# EAGLE design djshield2 (EAGLE 6.4)
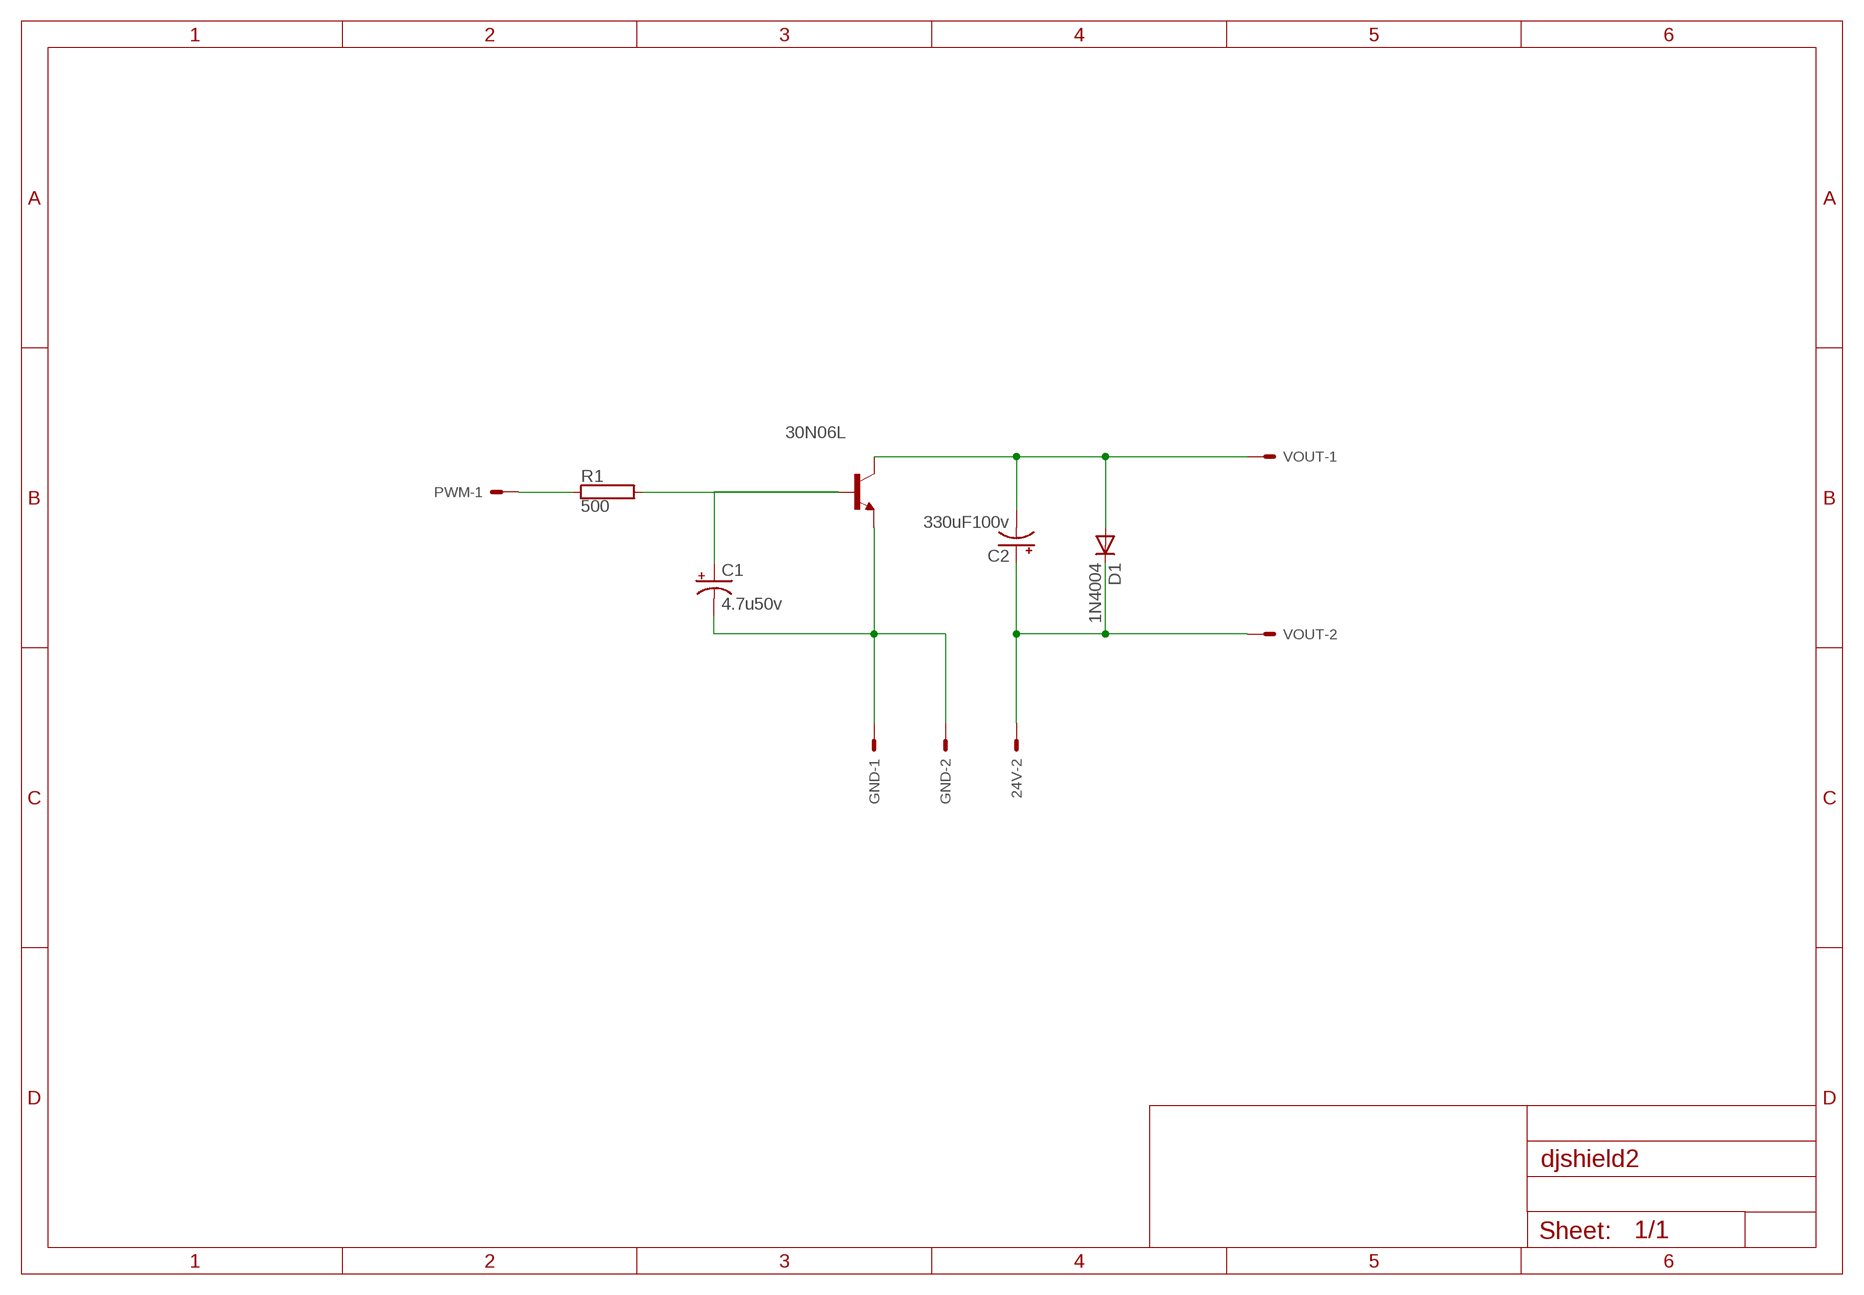
[diagram p0: schematic, sheet 1]

## Parts
24V  87758-0216  [87758-0216]
30N06L  -NPN-TO126  [TO126]
C1  4.7u50v  CPOL-USE1.8-4  [E1,8-4]
C2  330uF100v  CPOL-USE35-18AXIAL  [E35-18]
D1  1N4004  [DO41-10]
GND  87758-0216  [87758-0216]
PWM  87758-0216  [87758-0216]
R1  500  RRS1/4  [RS1/4]
VOUT  87758-0216  [87758-0216]

## Nets
N$1 [power]: 30N06L.1(E) C1.- GND.1 GND.2
N$2: 30N06L.2(C) C2.- D1.A VOUT.1
N$3: 24V.2 C2.+ D1.C VOUT.2
N$8: 30N06L.3(B) C1.+ R1.2
N$10 [power]: PWM.1 R1.1
Unconnected: 24V.1 PWM.2

## Library data of the parts
24V GND PWM VOUT = con-molex:87758-0216: 2 Pin - 2mm Dual Row Single Wafer, Vertical T/H HDR Source: http://www.molex.com/pdm_docs/sd/877580616_sd.pdf; MPN: 87758-0216; OC_FARNELL: unknown; OC_NEWARK: 94M1513
30N06L = transistor:*-NPN-: NPN Transistror BF959 corrected 2008.03.06
C1 = resistor:CPOL-US: POLARIZED CAPACITOR, American symbol
C2 = rcl:CPOL-US: POLARIZED CAPACITOR, American symbol
D1 = diode:1N4004: DIODE general purpose rectifier, 1 A
R1 = resistor-power:R: Power Resitor; MF: OHMITE; MPN: RRS1K0; OC_FARNELL: unknown; OC_NEWARK: 01F7661

## Net classes
1 power: width 0.508 mm, drill 0.5 mm, clearance 0.305 mm

## Board
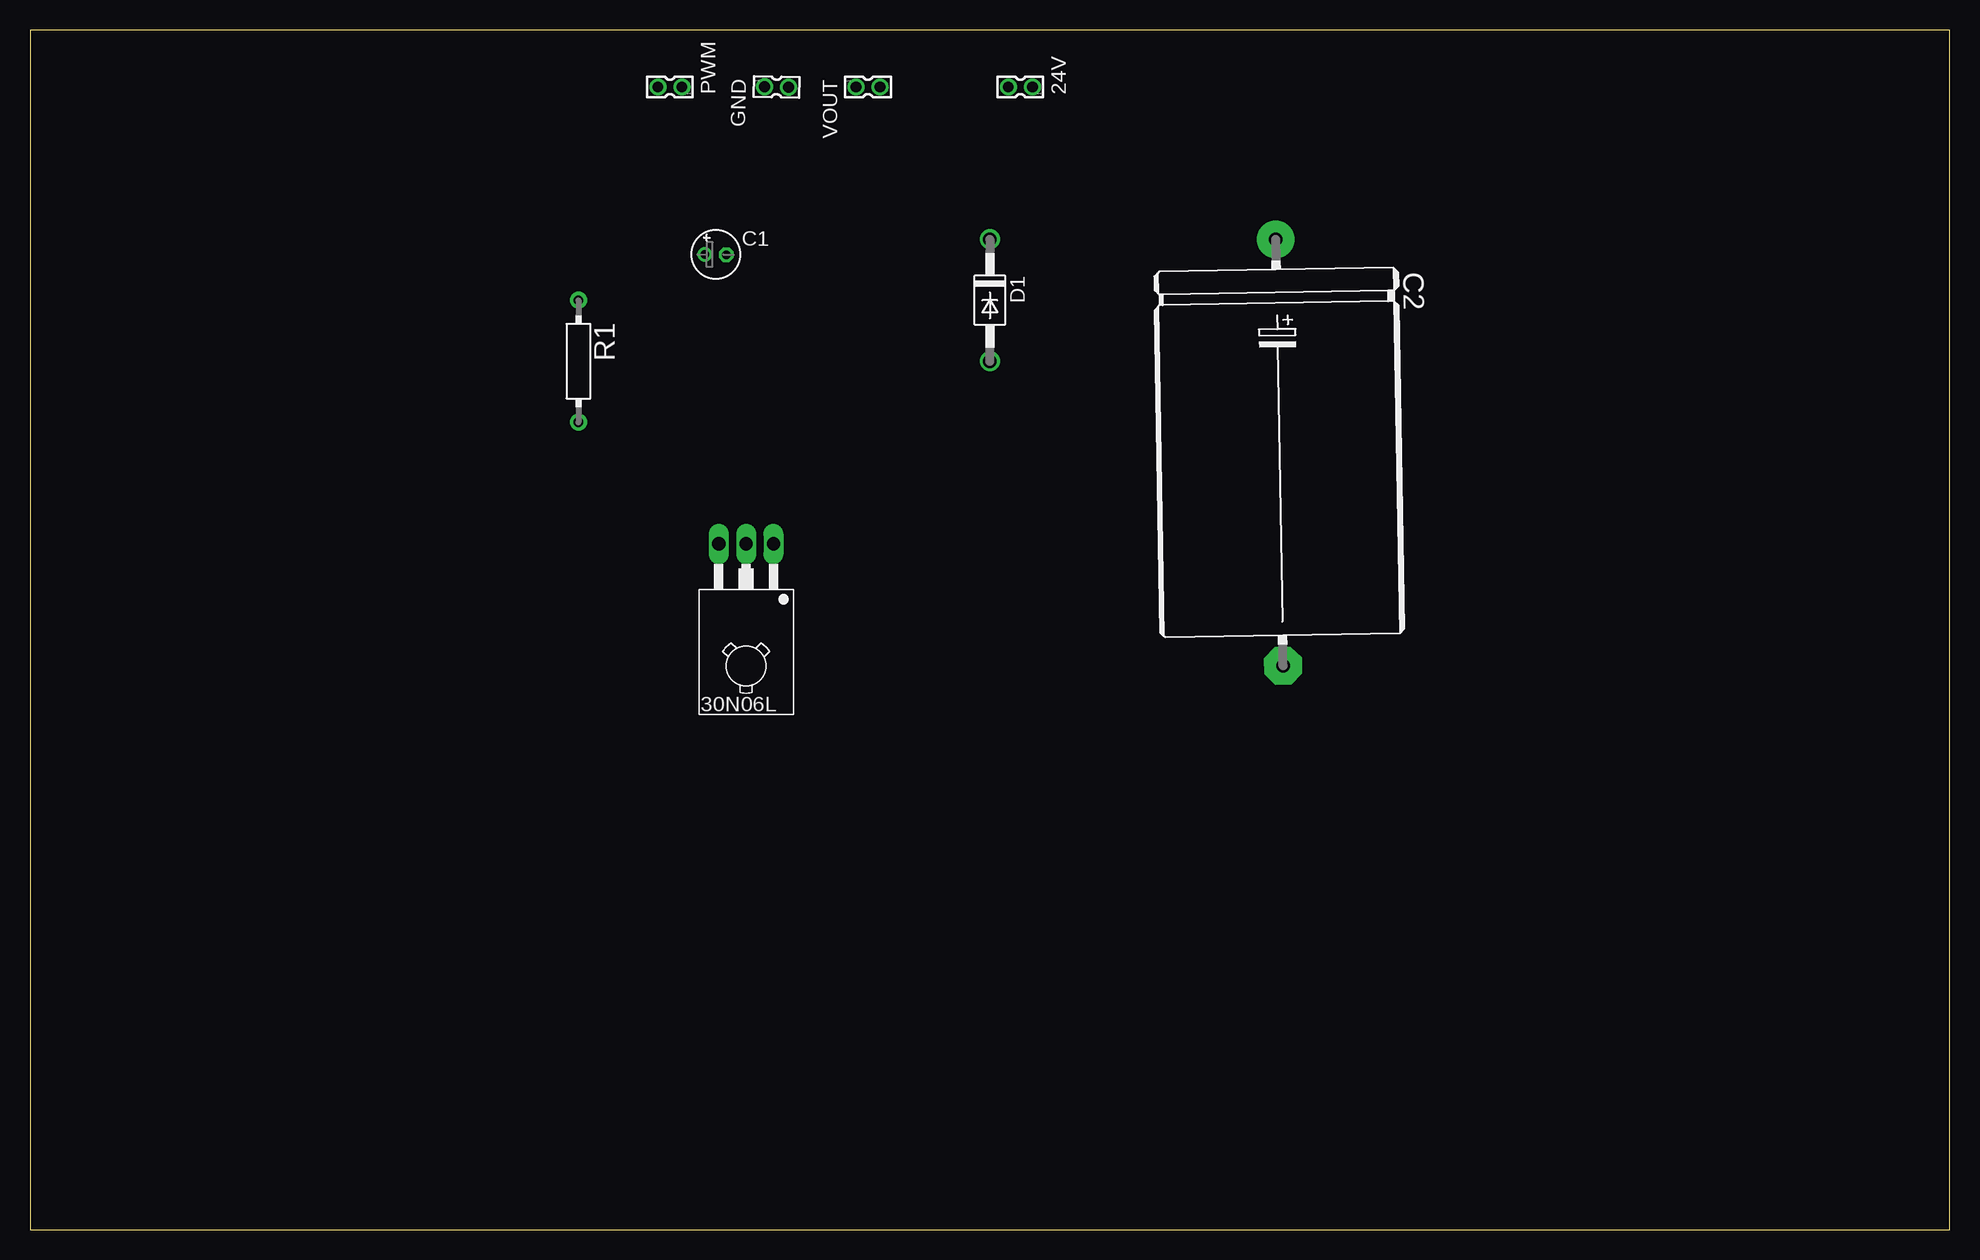
[diagram p1: board, top side]
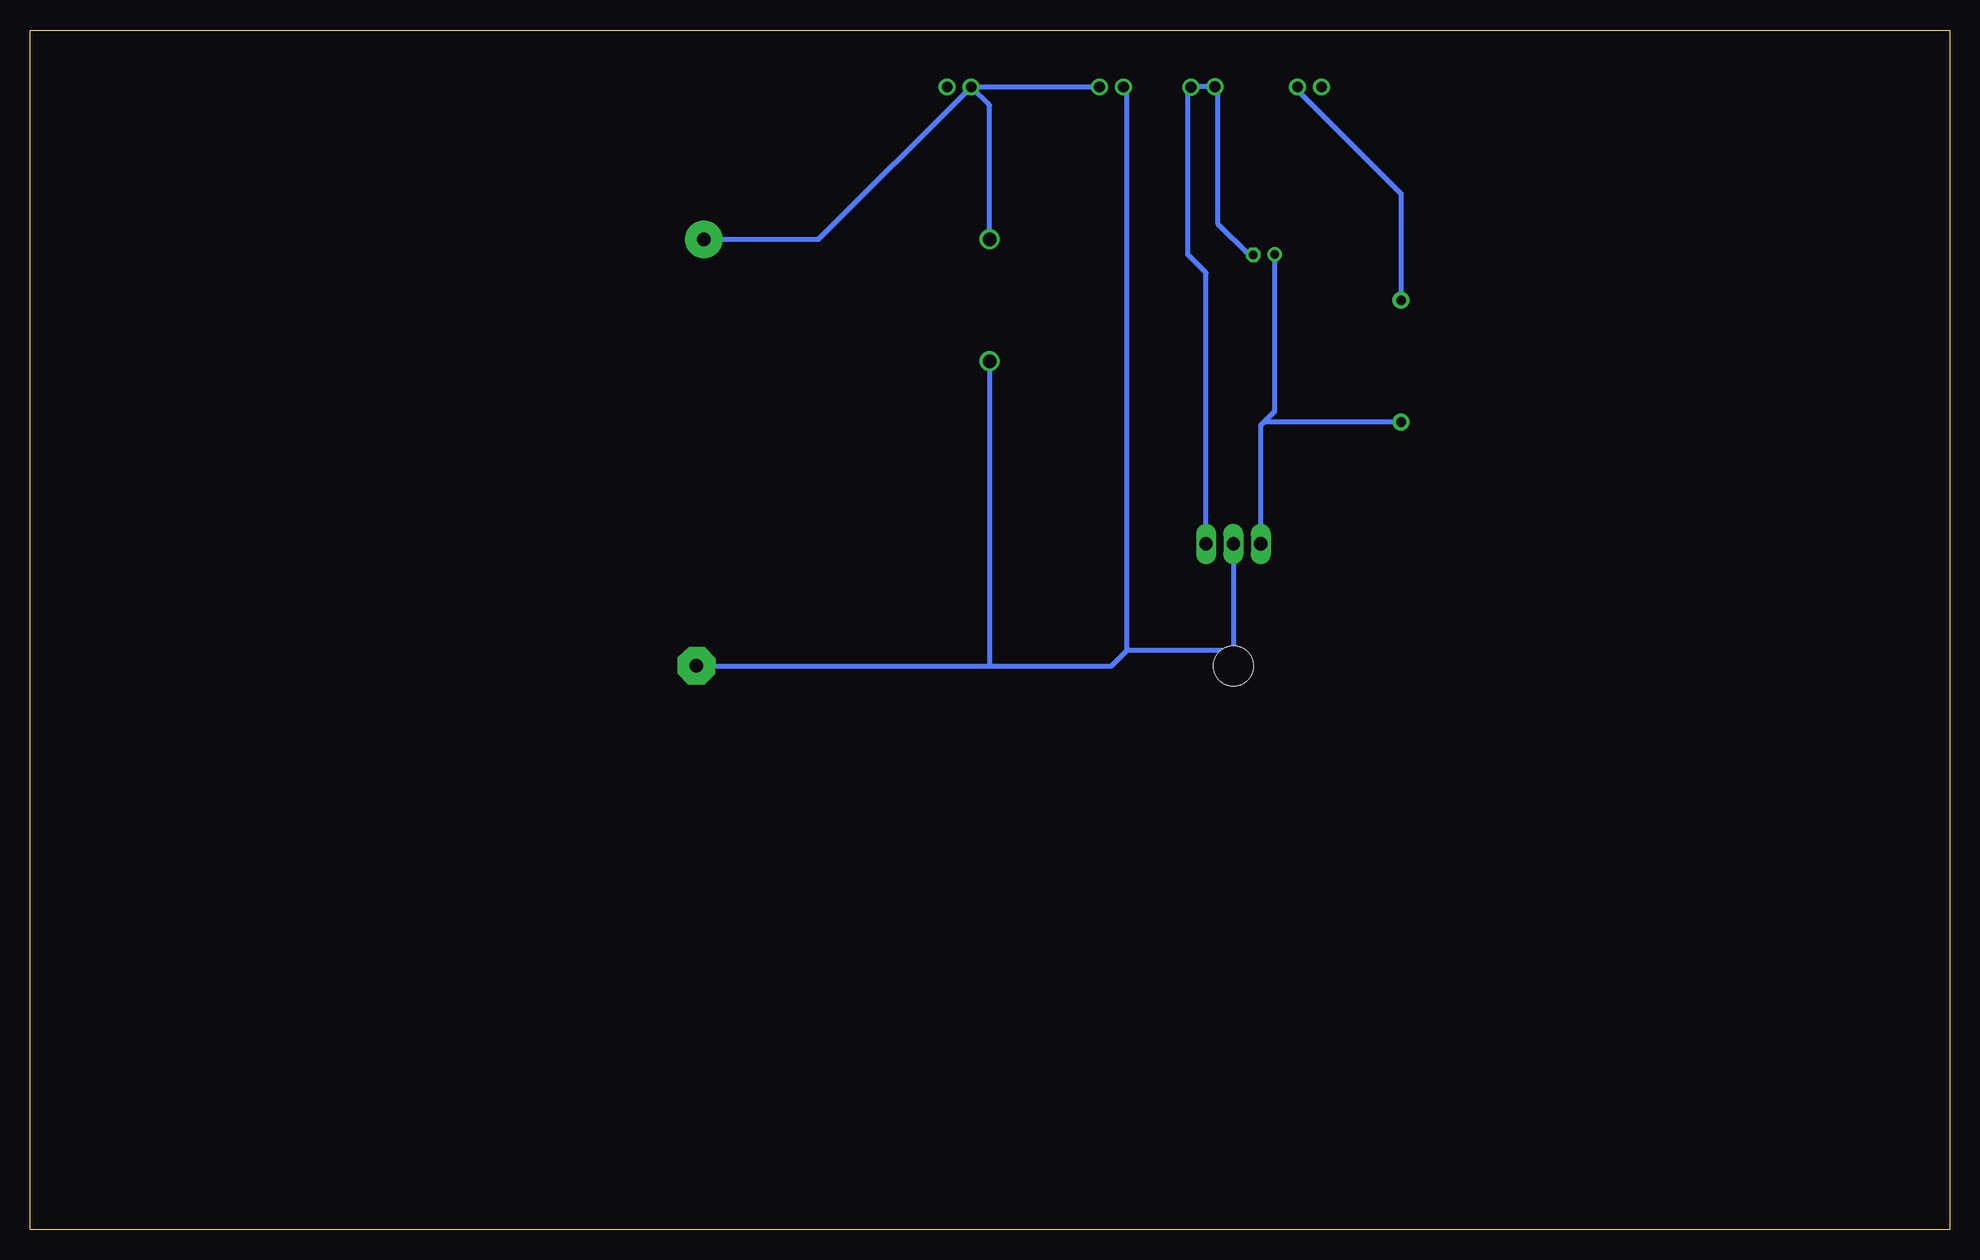
[diagram p2: board, bottom side, seen from below]

Size 160 x 100 mm. Coordinates in mm from the lower left corner, seen from the top.
Outline: 0,0 160,0 160,100 0,100 0,0
Copper layers (1*16): Top 0.035mm / dielectric 1.5mm / Bottom 0.035mm
Design rules "default": minimum track width 10mil, minimum drill 24mil, track to track 8mil, track to pad 8mil, pad to pad 8mil, via to via 8mil, smd to smd 8mil, copper to edge 40mil, drill to drill 8mil, minimum pad ring 10mil, minimum via ring 8mil, stop-mask expansion 4mil, vias tented up to drill 0mil, thermal gap 10mil

### Footprints (pad centres in the part's own frame; a part is rotated, then mirrored left to right if it is on the bottom)
87758-0216 = drill 0.9 pad 1.27: 1 0,-1; 2 0,1
TO126 = drill 1.118 long: 1 -2.286,-5.08; 2 0,-5.08; 3 2.286,-5.08 | hole 3.302: 0,5.08
E1,8-4 = drill 0.711 pad 1.168: + -0.889,0 | drill 0.711 pad 1.168 octagon: - 0.889,0
E35-18 = drill 1.118 pad 3.15: + -17.78,0 | drill 1.118 pad 3.15 octagon: - 17.78,0
DO41-10 = drill 1.118: A 5.08,0; C -5.08,0
RS1/4 = drill 0.8 pad 1.4: 1 -5.08,0; 2 5.08,0

### Placement (x,y rotation side)
24V  82.55,95.25 90 top
30N06L  59.69,52.07 180 top
C1  57.15,81.28 359.2 top
C2  104.14,64.77 271 top
D1  80.01,77.47 270 top
GND  62.23,95.25 268.9 top
PWM  53.34,95.25 90 top
R1  45.72,72.39 270 top
VOUT  69.85,95.25 270 top

### Tracks (layer width: path | path; a pad name or v marks a point on that pad's centre or on a via)
N$1
  Bottom 0.406: 30N06L.1 61.98,79.76 63.5,81.28 63.5,94.96 GND.2 63.19,95.27 GND.1 60.96,95 60.96,83.82 58.41,81.27 C1.-
N$2
  Bottom 0.406: 30N06L.2 59.69,48.26 68.58,48.26 | 68.58,48.26 68.58,94.98 VOUT.1 | C2.- 80.01,46.99 | 80.01,46.99 69.85,46.99 68.58,48.26 | D1.A 80.01,46.99
N$3
  Bottom 0.406: C2.+ 94.25,82.55 24V.2 | D1.C 80.01,93.71 24V.2 | VOUT.2 24V.2
N$8
  Bottom 0.406: R1.2 57.15,67.31 | C1.+ 56.26,68.2 57.15,67.31 | 30N06L.3 57.4,67.06 57.15,67.31
N$10
  Bottom 0.406: PWM.1 54.34,94.98 45.72,86.36 R1.1